# EAGLE schematic Hub_Teensy3 (EAGLE 6.1)
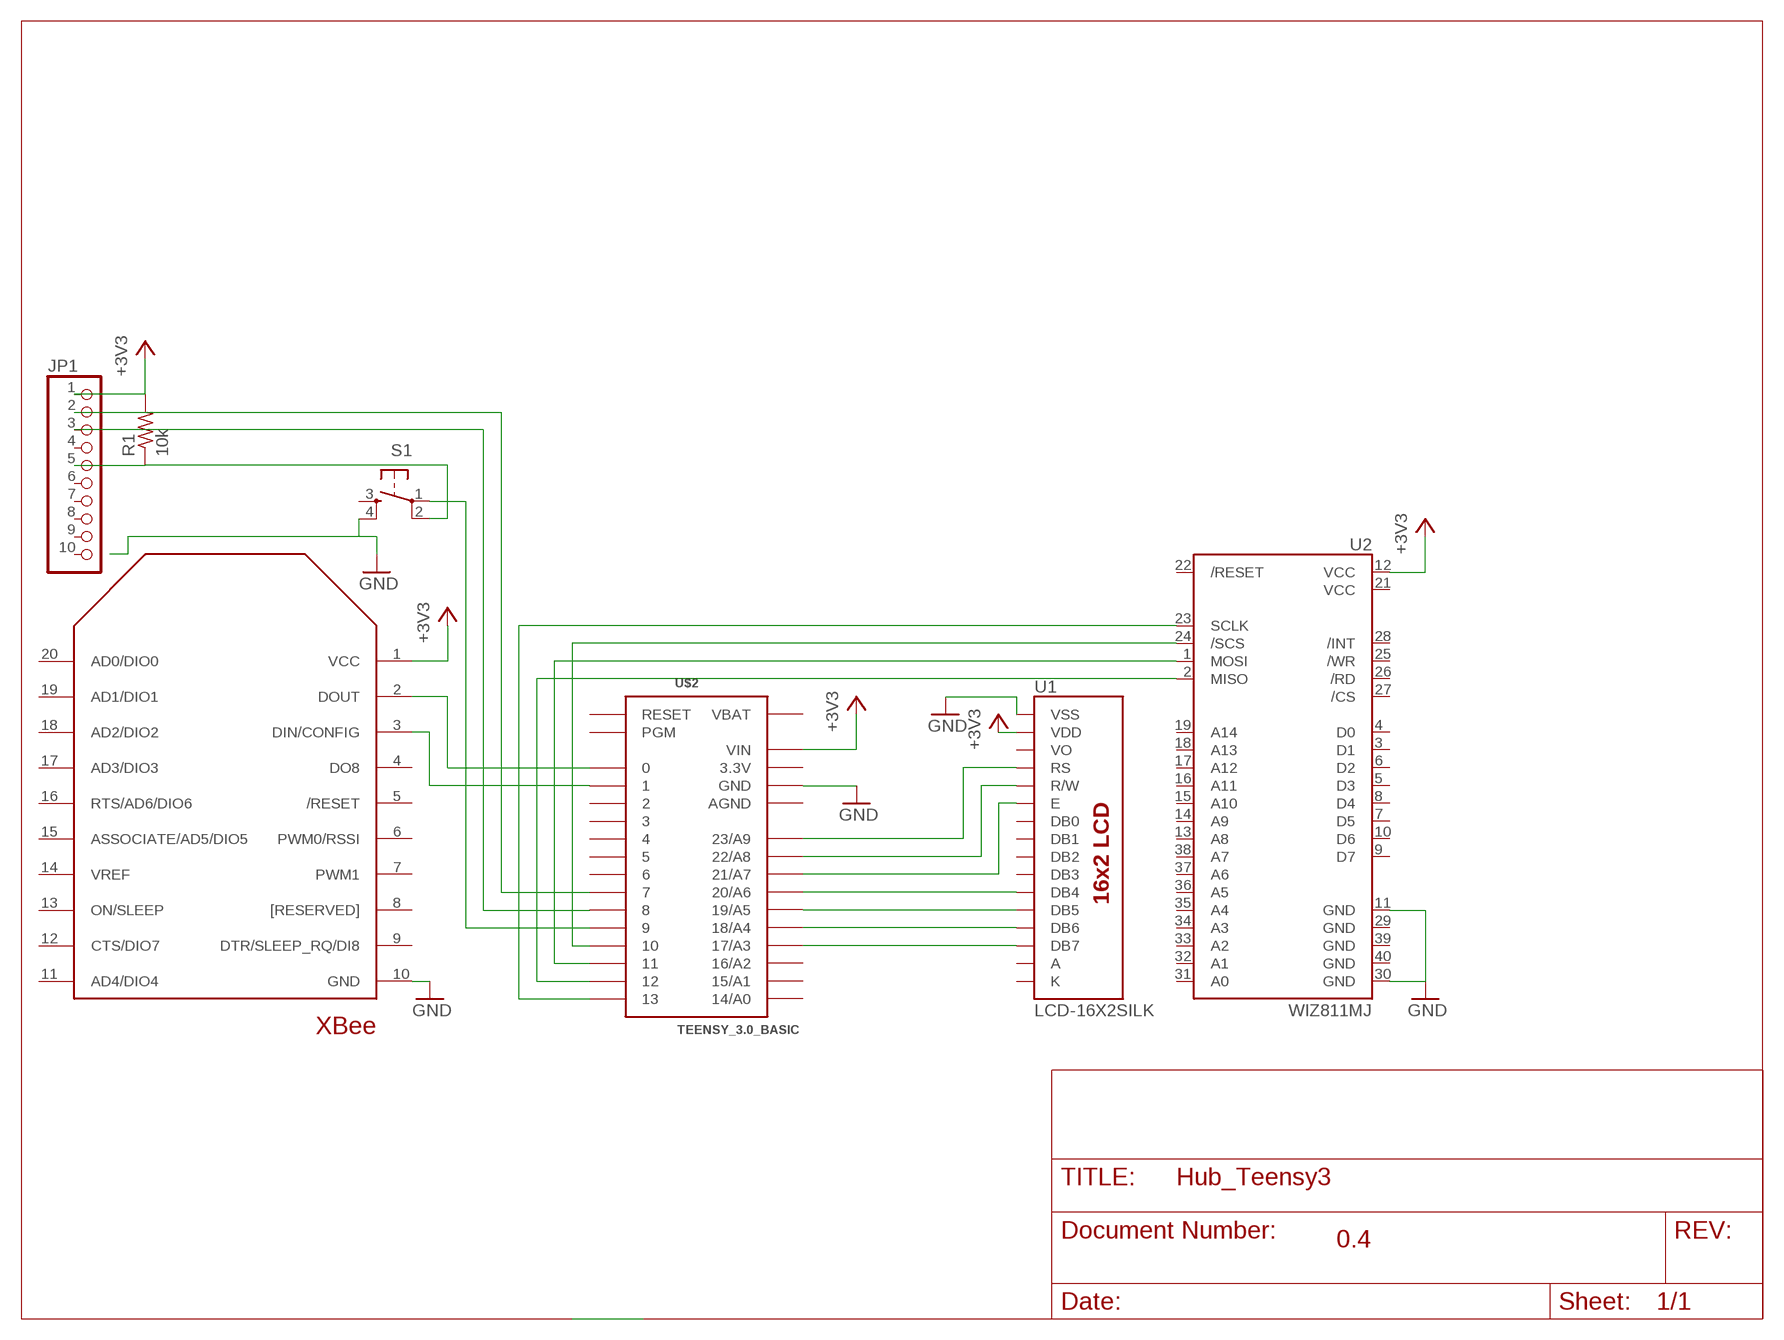
[diagram p0: schematic, sheet 1]

## Parts
JP1  PINHD-1X10  [1X10]
R1  10k  R-US_0207/7  [0207/7]
S1  TAC_SWITCHPTH  [TACTILE-PTH]
U1  LCD-16X2SILK  [LCD-16X2]
U2  WIZ811MJ  [WIZ811MJ]
U$1  XBEE  [XBEE]
U$2  TEENSY_3.0_BASIC  [TEENSY_3.0_BASIC]

## Nets
+3V3: JP1.1 R1.2 U1.2(VDD) U2.12(VCC) U$1.1(VCC) U$2.VIN
GND: S1.4 U1.1(VSS) U2.11(GND) U2.30(GND) U$1.10(GND) U$2.GND U$2.GND1(GND)
N$1: U1.13(DB6) U$2.18/A4
N$2: U1.12(DB5) U$2.19/A5
N$3: U1.11(DB4) U$2.20/A6
N$4: U1.6(E) U$2.21/A7
N$5: U1.4(RS) U$2.23/A9
N$6: U1.5(R/W) U$2.22/A8
N$8: U2.23(SCLK) U$2.13
N$9: U2.24(/SCS) U$2.10
N$10: U2.1(MOSI) U$2.11
N$11: U2.2(MISO) U$2.12
N$12: U$1.3(DIN/CONFIG) U$2.1
N$14: JP1.2 U$2.7
N$15: JP1.3 U$2.8
N$16: U1.14(DB7) U$2.17/A3
N$17: U$1.2(DOUT) U$2.0
N$23: JP1.5 R1.1 S1.2
N$25: S1.1 U$2.9
Unconnected: JP1.4 JP1.6 JP1.7 JP1.8 JP1.9 JP1.10 S1.3 U1.3(VO) U1.7(DB0) U1.8(DB1) U1.9(DB2) U1.10(DB3) U2.3(D1) U2.4(D0) U2.5(D3) U2.6(D2) U2.7(D5) U2.8(D4) U2.9(D7) U2.10(D6) U2.13(A8) U2.14(A9) U2.15(A10) U2.16(A11) U2.17(A12) U2.18(A13) U2.19(A14) U2.21(VCC) U2.22(/RESET) U2.25(/WR) U2.26(/RD) U2.27(/CS) U2.28(/INT) U2.29(GND) U2.31(A0) U2.32(A1) U2.33(A2) U2.34(A3) U2.35(A4) U2.36(A5) U2.37(A6) U2.38(A7) U2.39(GND) U2.40(GND) U$1.4(DO8) U$1.5(/RESET) U$1.6(PWM0/RSSI) U$1.7(PWM1) U$1.8([RESERVED]) U$1.9(DTR/SLEEP_RQ/DI8) U$1.11(AD4/DIO4) U$1.12(CTS/DIO7) U$1.13(ON/SLEEP) U$1.14(VREF) U$1.15(ASSOCIATE/AD5/DIO5) U$1.16(RTS/AD6/DIO6) U$1.17(AD3/DIO3) U$1.18(AD2/DIO2) U$1.19(AD1/DIO1) U$1.20(AD0/DIO0) U$2.2 U$2.3 U$2.4 U$2.5 U$2.6 U$2.14/A0 U$2.15/A1 U$2.16/A2 U$2.PGM U$2.RESET

## Notes on the sheet
- 0.4

## Power pins joined to a net without a drawn wire
3.3V: U$2.3.3V U$2.3.3V1(3.3V)
A: U1.15(A)
AGND: U$2.AGND
K: U1.16(K)
VBAT: U$2.VBAT

## Library data of the parts
JP1 = pinhead:PINHD-1X10: PIN HEADER
R1 = resistor:R-US_: RESISTOR, American symbol
S1 = SparkFun-Electromechanical:TAC_SWITCH: Momentary Switch Button commonly used for reset or general input. Spark Fun Electronics SKU : COM-00097 SMT- SWCH-08247
U1 = SparkFun-Displays:LCD-16X2: Standard text-only 16x2 parallel input LCD
U2 = SparkFun-Boards:WIZ811MJ: WIZnet W5100 Network Module with MagJack - WIZ811MJ WIZnet's WIZ811MJ is a breakout board for the W5100 embedded TCP/IP chip. Also included on the board is a RJ-45 MagJack Connector (RJ45 with X'FMR). See http://www.sparkfun.com/commerce/product_info.php?products_id=9473 for more documentation and info. **UNPROVEN
U$1 = CEDT:XBEE
U$2 = Teensy3-2.0:TEENSY_3.0_BASIC: Basic Teensy 3.0 with none of the 'inner' pins enabled. See '+4', 'AllAnalogPins", and 'AllPins' packages for additional pin holes, as needed.